# Altium schematic sheet SenzorGIT.SchDoc
size A2; SheetNumber: 3; SheetTotal: 3
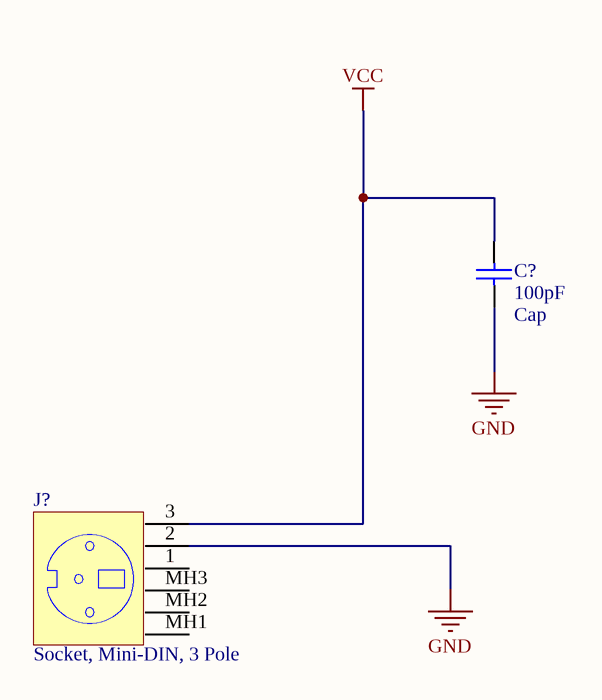
[diagram p0: SenzorGIT.SchDoc]

## Parts
C?  Cap  value 100pF  [RAD-0.3]
J?  Socket, Mini-DIN, 3 Pole  [SCHURTER - 4850.231]

## Nets
GND: C?.1 J?.2
VCC: C?.2 J?.3

Not connected (* = marked no-connect by the designer): J? 1 MH1(4) MH2(5) MH3(6)

## Library data of the parts
C? = Cap: Capacitor; Published: 8-Jun-2000; LatestRevisionDate: 17-Jul-2002; LatestRevisionNote: Re-released for DXP Platform.; PackageReference: RAD-0.3; Publisher: Altium Limited; PackageDescription: Radial Cap, Thru-Hole; 2 Leads; 0.3 in Pin Spacing
J? = Socket_Mini-DIN_3: SOCKET, MINI-DIN, PCB, 3 POLE